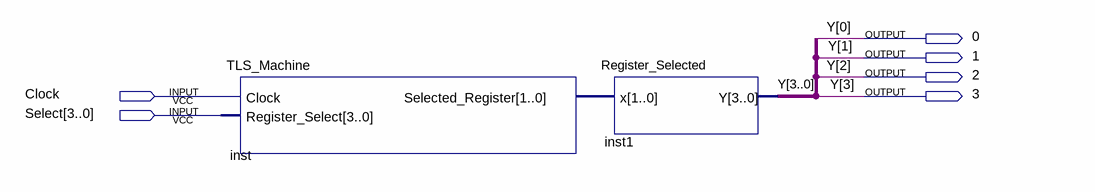
[diagram p0: schematic sheet]
// Quartus schematic TLS_Test.bdf as structural Verilog: 2 symbols, 6 pins
module TLS_Test (
  input  Clock,
  input  [3:0] Select,
  output \0 ,
  output \1 ,
  output \2 ,
  output \3 
);

  wire [1:0] inst_selected_register;

  TLS_Machine inst (.Clock(Clock), .Register_Select(Select), .Selected_Register(inst_selected_register));
  Register_Selected inst1 (.x(inst_selected_register), .Y({\3 , \2 , \1 , \0 }));

  // Other names for the same wires on the sheet: Y[3:0] = {\3 , \2 , \1 , \0 }
endmodule
